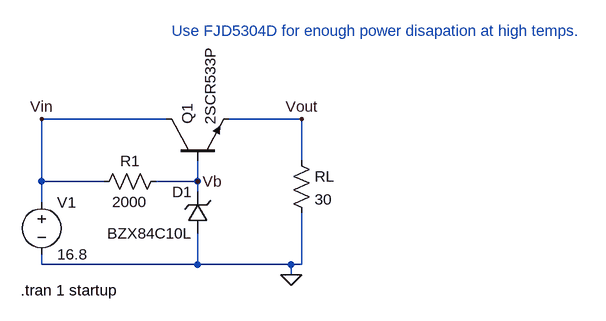
[diagram p0: schematic 9V_Reg.asc]
9V_Reg.asc, the LTspice schematic file:
Version 4
SHEET 1 880 680
WIRE 160 48 -32 48
WIRE 368 48 256 48
WIRE 368 112 368 48
WIRE -32 144 -32 48
WIRE 64 144 -32 144
WIRE 208 144 208 112
WIRE 208 144 144 144
WIRE 208 160 208 144
WIRE -32 176 -32 144
WIRE -32 272 -32 256
WIRE 208 272 208 224
WIRE 208 272 -32 272
WIRE 352 272 208 272
WIRE 368 272 368 192
WIRE 368 272 352 272
WIRE 352 288 352 272
FLAG 352 288 0
FLAG 368 48 Vout
FLAG -32 48 Vin
FLAG 208 144 Vb
SYMBOL zener 224 224 R180
WINDOW 0 24 64 Left 2
WINDOW 3 24 0 Left 2
SYMATTR InstName D1
SYMATTR Value BZX84C10L
SYMATTR Description Diode
SYMATTR Type diode
SYMBOL res 352 96 R0
SYMATTR InstName RL
SYMATTR Value 30
SYMBOL res 160 128 R90
WINDOW 0 0 56 VBottom 2
WINDOW 3 32 56 VTop 2
SYMATTR InstName R1
SYMATTR Value 2000
SYMBOL voltage -32 160 R0
WINDOW 123 0 0 Left 0
WINDOW 39 0 0 Left 0
SYMATTR InstName V1
SYMATTR Value 16.8
SYMBOL npn 160 112 R270
SYMATTR InstName Q1
SYMATTR Value 2SCR533P
TEXT -64 312 Left 2 !.tran 1 startup
TEXT 168 -88 Left 2 ;Use FJD5304D for enough power disapation at high temps.

The netlist it stands for:
* 9V_Reg.asc
D1 0 Vb BZX84C10L
RL Vout 0 30
R1 Vb Vin 2000
V1 Vin 0 16.8
Q1 Vin Vb Vout 0 2SCR533P
.model D D
.lib standard.dio
.model NPN NPN
.model PNP PNP
.lib standard.bjt
.tran 1 startup
* Use FJD5304D for enough power disapation at high temps.
.backanno
.end